# EasyEDA schematic Stacja lutownicza v2.json
TITLE: Sheet_1; REV: 1.0; Date: 2020-08-05; Sheet: 1/1; Company: Your Company
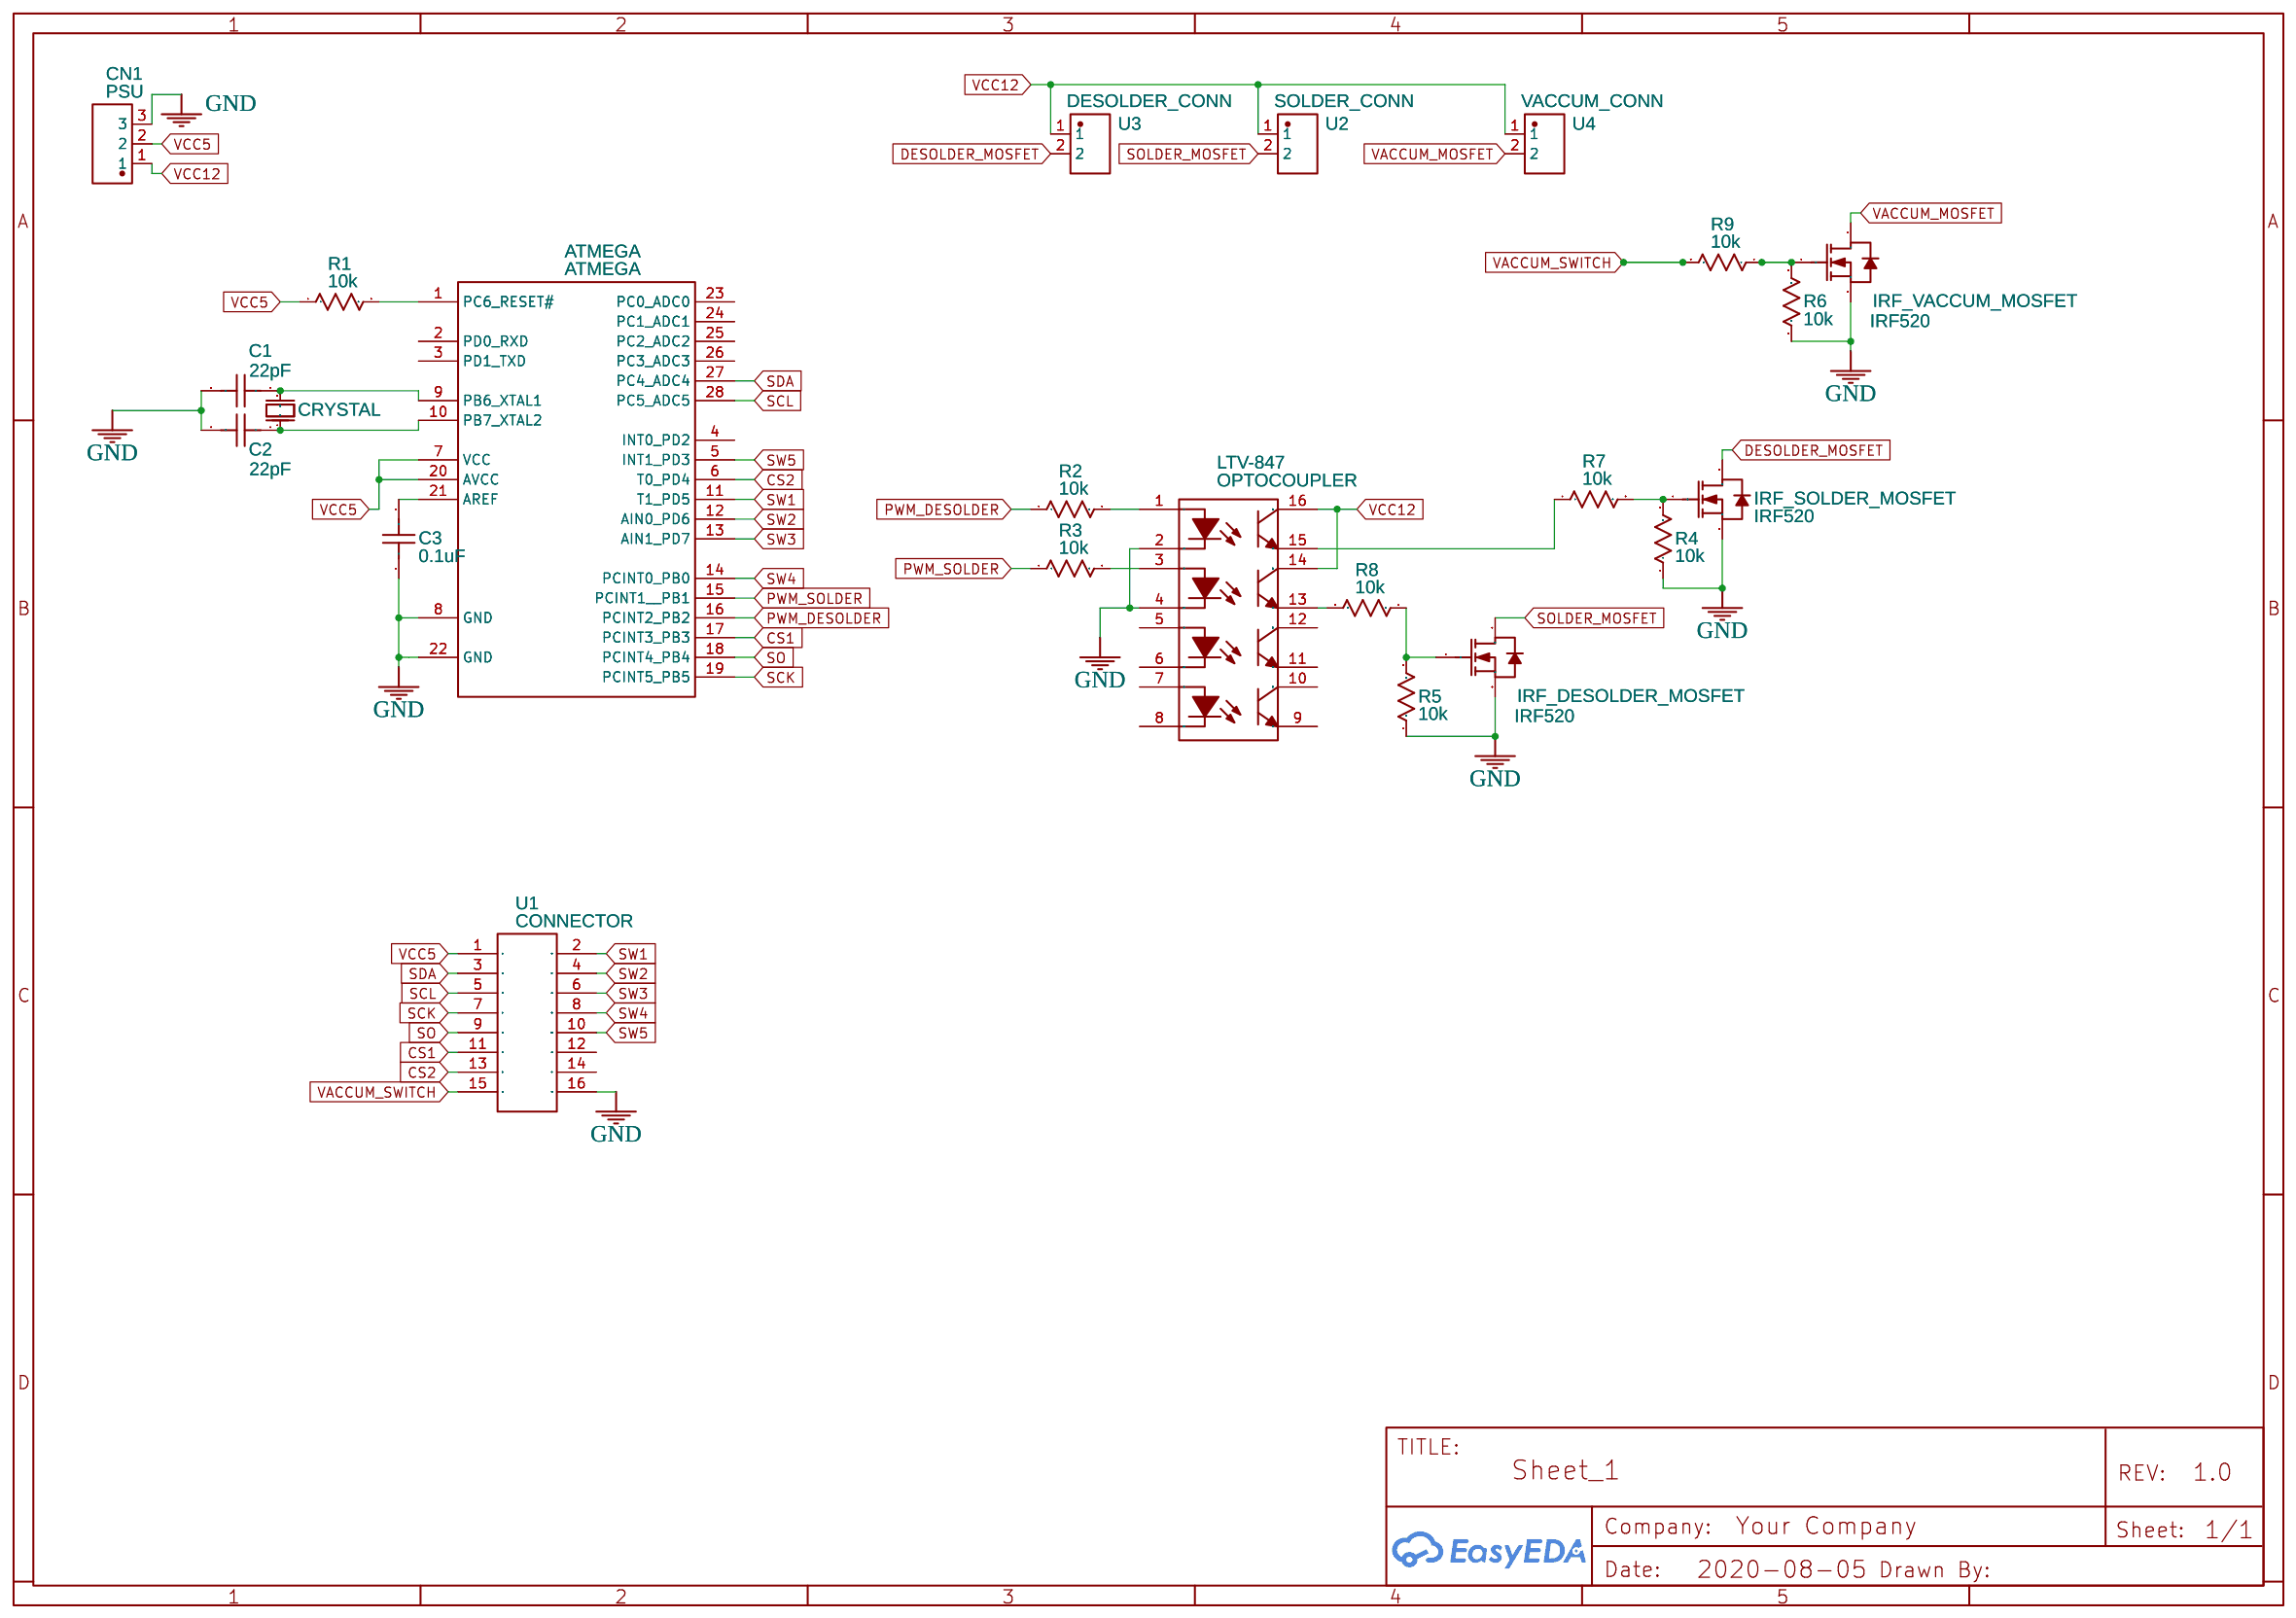
[diagram p0: schematic sheet]

## Parts
ATMEGA  ATMEGA  [DIP-28_L34.6-W7.3-P2.54-LS10.2-BL]
C1  22pF  [CAP-TH_L7.2-W2.5-P5.00-D0.6]
C2  22pF  [CAP-TH_L7.2-W2.5-P5.00-D0.6]
C3  0.1uF  [CAP-TH_L7.2-W2.5-P5.00-D0.6]
CN1  PSU  [CONN-TH_3P-P5.00_WJ103V-3P]
IRF_DESOLDER_MOSFET  IRF520  [TO-220-3_L10.0-W4.5-P2.54-T]
IRF_SOLDER_MOSFET  IRF520  [TO-220-3_L10.0-W4.5-P2.54-T]
IRF_VACCUM_MOSFET  IRF520  [TO-220-3_L10.0-W4.5-P2.54-T]
LTV-847  OPTOCOUPLER  [DIP-16_16P-L20.2-W6.6-P2.54-LS7.6-BL]
R1  10k  [PKG-0.25W RESISTOR]
R2  10k  [PKG-0.25W RESISTOR]
R3  10k  [PKG-0.25W RESISTOR]
R4  10k  [PKG-0.25W RESISTOR]
R5  10k  [PKG-0.25W RESISTOR]
R6  10k  [PKG-0.25W RESISTOR]
R7  10k  [PKG-0.25W RESISTOR]
R8  10k  [PKG-0.25W RESISTOR]
R9  10k  [PKG-0.25W RESISTOR]
U1  CONNECTOR  [IDC16 2.54 28X8.7 MM]
U2  SOLDER_CONN  [CONN-TH_2P-P2.54_JL301-50002U02]
U3  DESOLDER_CONN  [CONN-TH_2P-P2.54_JL301-50002U02]
U4  VACCUM_CONN  [CONN-TH_2P-P2.54_JL301-50002U02]
X1  CRYSTAL  [HC-49S]

## Library data of the parts
ATMEGA = ATMEGA328P-PU: sourceId: Oic6oiASL; Supplier: LCSC; Manufacturer: MICROCHIP; image: //image.lceda.cn/szlcsc/C33901.jpg; Contributor: LCSC; Supplier Part: C33901
C1-C3 = SMEC224J100M2: Supplier: LCSC; Supplier Part: C401099; Manufacturer: CHAMPION; Contributor: LCSC
CN1 = WJ103-5.00-3P: Supplier: LCSC; Manufacturer: ReliaPro; image: //image.lceda.cn/szlcsc/C8427.jpg; Supplier Part: C8427
IRF_DESOLDER_MOSFET IRF_SOLDER_MOSFET IRF_VACCUM_MOSFET = IRF520NPBF: Supplier: LCSC; Manufacturer: IR; Supplier Part: C2598
LTV-847 = LTV-847: Supplier: LCSC; Manufacturer: LITEON; Supplier Part: C10794
R1-R9 = 10k: Power: 1/4W; Tolerance: ±5%; Supplier Part: 9339116; Supplier: Element14; Manufacturer: MULTICOMP; Manufacturer Part: MCF 0.25W 10K; Link: http://www.farnell.com/datasheets/1716725.pdf?_ga=2.130313612.2023696496.1506695686-238689616.1505921947&_gac=1.45287312.1506011718.EAIaIQobChMI57GX6tq21gIVTzobCh2WXgT2EAAYASAAEgKn9_D_BwE; Contributor: Prof. Ing. F. Scordino
U1 = IDC16 2.54 28x8.7 mm: Contributor: julien.pitault.1984
U2-U4 = JL301-50002U02: Supplier: LCSC; Supplier Part: C395214; Manufacturer: JILN; Contributor: LCSC
X1 = 49S9M20PF20PPMROHS: Supplier: LCSC; Manufacturer: LCSC; Supplier Part: C52064

## Nets
GND: ATMEGA.8(GND) ATMEGA.22(GND) C1.2 C2.2 C3.2 CN1.3 IRF_DESOLDER_MOSFET.3(S) IRF_SOLDER_MOSFET.3(S) IRF_VACCUM_MOSFET.3(S) LTV-847.2(CAT) LTV-847.4(CAT) R4.1 R5.1 R6.1 U1.16
VCC5: ATMEGA.7(VCC) ATMEGA.20(AVCC) CN1.2 R1.1 U1.1(P1)
VCC12: CN1.1 LTV-847.14(COL) LTV-847.16(COL) U2.1 U3.1 U4.1
CS1: ATMEGA.17(PCINT3 PB3) U1.11
CS2: ATMEGA.6(T0 PD4) U1.13
DESOLDER_MOSFET: IRF_SOLDER_MOSFET.2(D) U3.2
PWM_DESOLDER: ATMEGA.16(PCINT2 PB2) R2.1
PWM_SOLDER: ATMEGA.15(PCINT1  PB1) R3.1
SCK: ATMEGA.19(PCINT5 PB5) U1.7(P7)
SCL: ATMEGA.28(PC5 ADC5) U1.5(P5)
SDA: ATMEGA.27(PC4 ADC4) U1.3(P3)
SO: ATMEGA.18(PCINT4 PB4) U1.9(P9)
SOLDER_MOSFET: IRF_DESOLDER_MOSFET.2(D) U2.2
SW1: ATMEGA.11(T1 PD5) U1.2(P2)
SW2: ATMEGA.12(AIN0 PD6) U1.4(P4)
SW3: ATMEGA.13(AIN1 PD7) U1.6(P6)
SW4: ATMEGA.14(PCINT0 PB0) U1.8(P8)
SW5: ATMEGA.5(INT1 PD3) U1.10(P10)
VACCUM_MOSFET: IRF_VACCUM_MOSFET.2(D) U4.2
VACCUM_SWITCH: R9.2 U1.15
Net-(ATMEGA-1): ATMEGA.1(PC6 RESET#) R1.2
Net-(ATMEGA-9): ATMEGA.9(PB6 XTAL1) C1.1 X1.2(OSC2)
Net-(ATMEGA-10): ATMEGA.10(PB7 XTAL2) C2.1 X1.1(OSC1)
Net-(ATMEGA-21): ATMEGA.21(AREF) C3.1
Net-(IRF_DESOLDER_MOSFET-1): IRF_DESOLDER_MOSFET.1(G) R5.2 R8.1
Net-(IRF_SOLDER_MOSFET-1): IRF_SOLDER_MOSFET.1(G) R4.2 R7.2
Net-(IRF_VACCUM_MOSFET-1): IRF_VACCUM_MOSFET.1(G) R6.2 R9.1
Net-(LTV-847-1): LTV-847.1(AN) R2.2
Net-(LTV-847-3): LTV-847.3(AN) R3.2
Net-(LTV-847-13): LTV-847.13(EM) R8.2
Net-(LTV-847-15): LTV-847.15(EM) R7.1

Not connected (* = marked no-connect by the designer): ATMEGA 2(PD0 RXD) 3(PD1 TXD) 4(INT0 PD2) 23(PC0 ADC0) 24(PC1 ADC1) 25(PC2 ADC2) 26(PC3 ADC3); LTV-847 5(AN) 6(CAT) 7(AN) 8(CAT) 9(EM) 10(COL) 11(EM) 12(COL); U1 12 14
